# EAGLE design Composino (EAGLE 7.1.0)
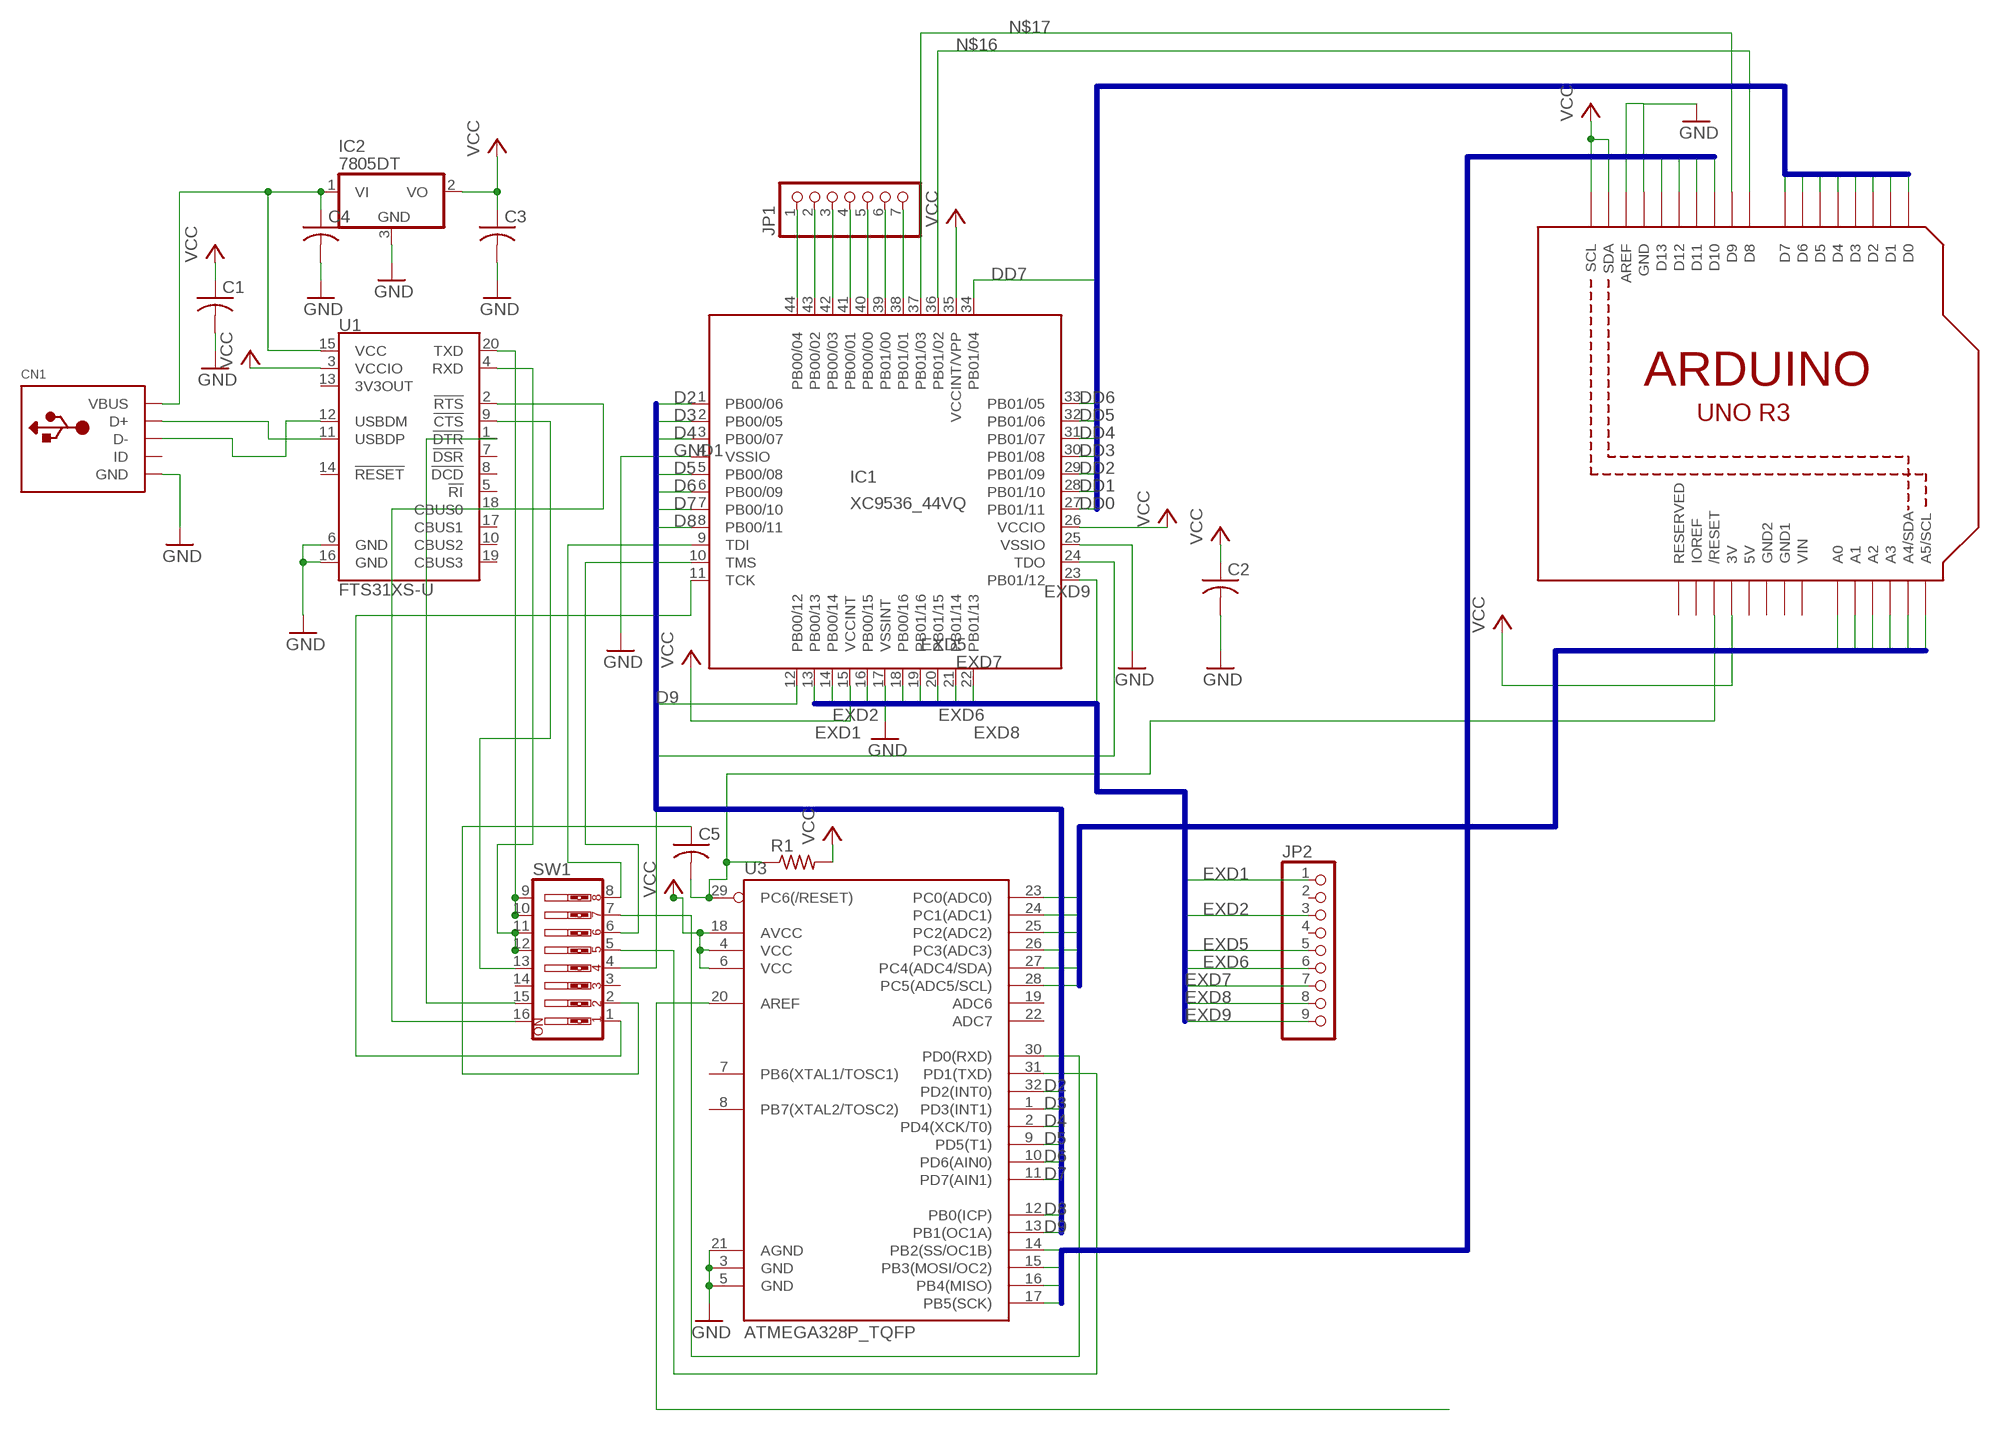
[diagram p0: schematic, sheet 1]

## Parts
C1  C-USC0603K  [C0603K]
C2  C-USC0603K  [C0603K]
C3  C-USC0603K  [C0603K]
C4  C-USC0603K  [C0603K]
C5  C-USC0603K  [C0603K]
CN1  USBMINIBLARGE  [USB-MINIB_LARGER]
IC1  XC9536_44VQ  [SQFP-S-10X10-44]
IC2  7805DT  [TO252]
JP1  HEADER-1X7  [1X07_OVAL]
JP2  HEADER-1X9  [1X09_OVAL]
R1  R-US_R0603  [R0603]
SW1  SW_DIP-8-SMT-HALFSIZE  [DIPSWITCH-08-50MIL]
U1  FTS31XS-U  FT231XS  [SSOP20_L]
U2  ARDUINOR3NODIM  [ARDUINOR3-NODIM]
U3  ATMEGA328P_TQFP  [TQFP32-08]

## Nets
A0: U2.A0 U3.23(PC0(ADC0))
A1: U2.A1 U3.24(PC1(ADC1))
A2: U2.A2 U3.25(PC2(ADC2))
A3: U2.A3 U3.26(PC3(ADC3))
A4: U2.A4(A4/SDA) U3.27(PC4(ADC4/SDA))
A5: U2.A5(A5/SCL) U3.28(PC5(ADC5/SCL))
D2: IC1.1(PB00/06) U3.32(PD2(INT0))
D3: IC1.2(PB00/05) U3.1(PD3(INT1))
D4: IC1.3(PB00/07) U3.2(PD4(XCK/T0))
D5: IC1.5(PB00/08) U3.9(PD5(T1))
D6: IC1.6(PB00/09) U3.10(PD6(AIN0))
D7: IC1.7(PB00/10) U3.11(PD7(AIN1))
D8: IC1.8(PB00/11) U3.12(PB0(ICP))
D9: IC1.12(PB00/12) U3.13(PB1(OC1A))
D10: U2.D10 U3.14(PB2(SS/OC1B))
D11: U2.D11 U3.15(PB3(MOSI/OC2))
D12: U2.D12 U3.16(PB4(MISO))
D13: U2.D13 U3.17(PB5(SCK))
DD0: IC1.27(PB01/11) U2.D0
DD1: IC1.28(PB01/10) U2.D1
DD2: IC1.29(PB01/09) U2.D2
DD3: IC1.30(PB01/08) U2.D3
DD4: IC1.31(PB01/07) U2.D4
DD5: IC1.32(PB01/06) U2.D5
DD6: IC1.33(PB01/05) U2.D6
DD7: IC1.34(PB01/04) U2.D7
EXD1: IC1.13(PB00/13) JP2.1
EXD2: IC1.14(PB00/14) JP2.3
EXD3: IC1.16(PB00/15)
EXD4: IC1.18(PB00/16)
EXD5: IC1.19(PB01/16) JP2.5
EXD6: IC1.20(PB01/15) JP2.6
EXD7: IC1.21(PB01/14) JP2.7
EXD8: IC1.22(PB01/13) JP2.8
EXD9: IC1.23(PB01/12) JP2.9
GND1: C1.2 C2.2 C3.2 C4.2 CN1.GND IC1.4(VSSIO) IC1.17(VSSINT) IC1.25(VSSIO) IC2.3(GND) U1.6(GND) U1.16(GND) U2.AREF U2.GND U3.3(GND) U3.5(GND) U3.21(AGND) ; supply symbol labelled GND
N$1: CN1.D+ U1.11(USBDP)
N$2: CN1.D- U1.12(USBDM)
N$3: C4.1 CN1.VBUS IC2.1(VI) U1.15(VCC)
N$4: IC1.9(TDI) SW1.8
N$5: IC1.10(TMS) SW1.6
N$6: SW1.16 U1.2(!RTS)
N$7: IC1.24(TDO) SW1.4
N$8: SW1.9 SW1.10 U1.20(TXD)
N$9: SW1.7 U3.30(PD0(RXD))
N$10: SW1.11 SW1.12 U1.4(RXD)
N$11: SW1.15 U1.1(!DTR)
N$12: SW1.5 U3.31(PD1(TXD))
N$13: SW1.13 U1.9(!CTS)
N$14: C5.2 R1.1 U2.RESET(/RESET) U3.29(PC6(/RESET))
N$15: C5.1 SW1.2
N$16: IC1.36(PB01/02) U2.D8
N$17: IC1.37(PB01/03) U2.D9
N$18: IC1.38(PB01/01) JP1.7
N$19: IC1.39(PB01/00) JP1.6
N$20: U3.20(AREF)
N$21: IC1.40(PB00/00) JP1.5
N$22: IC1.41(PB00/01) JP1.4
N$23: IC1.42(PB00/03) JP1.3
N$24: IC1.43(PB00/02) JP1.2
N$25: IC1.44(PB00/04) JP1.1
N$26: IC1.11(TCK) SW1.1
VCC: C1.1 C2.1 C3.1 IC1.15(VCCINT) IC1.26(VCCIO) IC1.35(VCCINT/VPP) IC2.2(VO) R1.2 U1.3(VCCIO) U2.3V U2.SCL U2.SDA U3.4(VCC) U3.6(VCC) U3.18(AVCC)
Unconnected: CN1.ID JP2.2 JP2.4 SW1.3 SW1.14 U1.5(!RI) U1.7(!DSR) U1.8(!DCD) U1.10(CBUS2) U1.13(3V3OUT) U1.14(!RESET) U1.17(CBUS1) U1.18(CBUS0) U1.19(CBUS3) U2.IOREF U2.RESERVED U3.7(PB6(XTAL1/TOSC1)) U3.8(PB7(XTAL2/TOSC2)) U3.19(ADC6) U3.22(ADC7)

## Buses
D[2..9]
D[10..13]
A[0..5]
DD[0..7]
EXD[1..9]

## Power pins joined to a net without a drawn wire
5V: U2.5V
GND1: U2.GND1 U2.GND2
VIN: U2.VIN

## Library data of the parts
C1-C5 = rcl:C-US: CAPACITOR, American symbol
CN1 = OLED_mod:USB: USB Connectors USBMINIB - Surface Mount Female Mini-B USB Connector 4UConnector: 06564
IC1 = xilinx-xc9:XC9536_44VQ: xc9536_pc44 XC9500 In-System Programmable CPLD Family Auto generated by make-symbol-device-package-bsdl.ulp Rev. 34 Source: xc9536_vq44.bsd; MPN: XC9536-15VQG44C; OC_FARNELL: 1193227; OC_NEWARK: 98K3377
IC2 = adafruit:78*: Positive VOLTAGE REGULATOR Added bigger pads to the TO-92 package
JP1 = OLED_mod:HEADER-1X7: PIN HEADER
JP2 = OLED_mod:HEADER-1X9: PIN HEADER
R1 = resistor:R-US_: RESISTOR, American symbol
SW1 = SparkFun-Electromechanical:SW_DIP-8: DIP Switch 8 Position
U1 = SparkFun-DigitalIC:FT231X: FTDI FT231X Full Speed USB to Full-handshake UART This USB2.0 Full Speed IC offers a compact bridge to full handshake UART interfaces. The device is a UART, capable of operating up to 3MBaud, with low power consumption (8mA). The FT231X includes the complete FT-X series feature set and enables USB to be added into a system design quickly and easily over a UART interface.; PROD_ID: IC-11524
U2 = OLED_mod:ARDUINOR3: This is a new object for the new Arduino R3 - with extra pins that you may want to use (such as IOref, and duplicated A4/A5
U3 = SparkFun-DigitalIC:ATMEGA328P_TQFP; PROD_ID: IC-09069

## Board
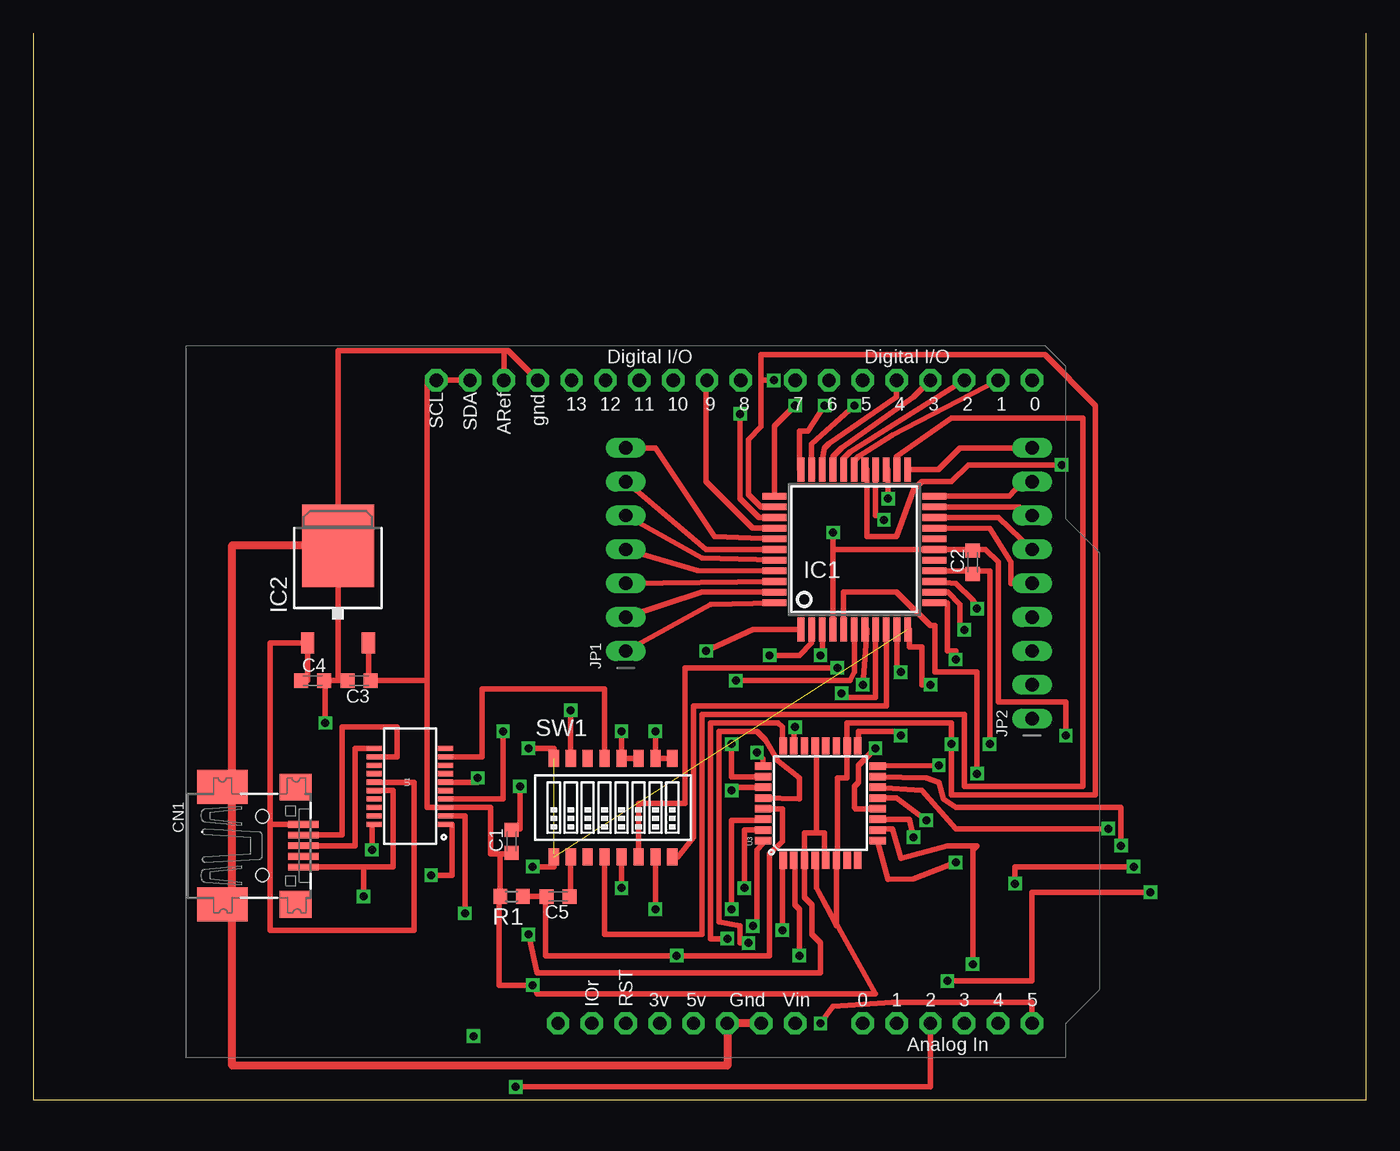
[diagram p1: board, top side]
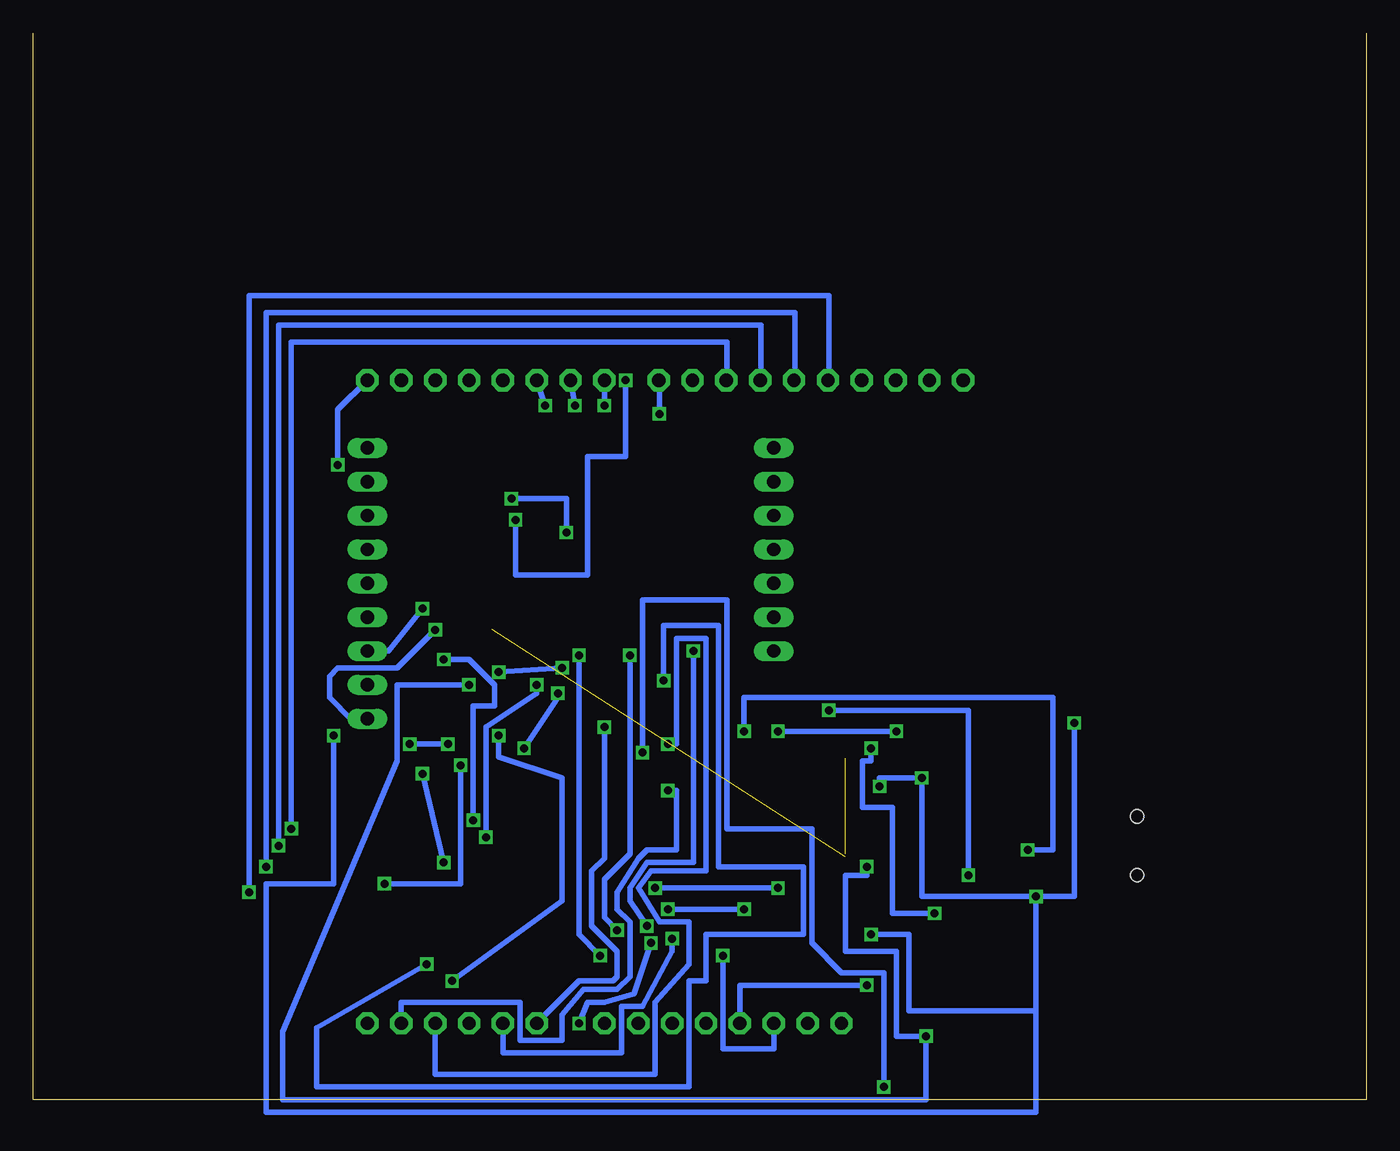
[diagram p2: board, bottom side, seen from below]

Size 100 x 80 mm. Coordinates in mm from the lower left corner, seen from the top.
Outline: 100,80 100,0 0,0 0,80
Copper layers (1*16): Top 0.035mm / dielectric 1.5mm / Bottom 0.035mm
Design rules "default": minimum track width 10mil, minimum drill 24mil, track to track 8mil, track to pad 8mil, pad to pad 8mil, via to via 8mil, smd to smd 8mil, copper to edge 40mil, drill to drill 8mil, minimum pad ring 10mil, minimum via ring 8mil, stop-mask expansion 4mil, vias tented up to drill 0mil, thermal gap 10mil

### Footprints (pad centres in the part's own frame; a part is rotated, then mirrored left to right if it is on the bottom)
C0603K = smd 1.05 x 1.08: 1 -0.875,0; 2 0.875,0
USB-MINIB_LARGER = smd 0.5 x 2.308: D+ 0,4.064; D- -0.8,4.064; GND 1.6,4.064; ID 0.8,4.064; VBUS -1.6,4.064 | smd 2.54 x 3.81: GND1 -4.4,-2; GND4 4.4,-2 | smd 2 x 2.4: GND2 -4.4,3.5; GND3 4.4,3.5 | hole 1: -2.2,1; 2.2,1
SQFP-S-10X10-44 = smd 0.5 x 1.8: 1 -4,-6; 2 -3.2,-6; 3 -2.4,-6; 4 -1.6,-6; 5 -0.8,-6; 6 0,-6; 7 0.8,-6; 8 1.6,-6; 9 2.4,-6; 10 3.2,-6; 11 4,-6; 23 4,6; 24 3.2,6; 25 2.4,6; 26 1.6,6; 27 0.8,6; 28 0,6; 29 -0.8,6; 30 -1.6,6; 31 -2.4,6; 32 -3.2,6; 33 -4,6 | smd 1.8 x 0.5: 12 6,-4; 13 6,-3.2; 14 6,-2.4; 15 6,-1.6; 16 6,-0.8; 17 6,0; 18 6,0.8; 19 6,1.6; 20 6,2.4; 21 6,3.2; 22 6,4; 34 -6,4; 35 -6,3.2; 36 -6,2.4; 37 -6,1.6; 38 -6,0.8; 39 -6,0; 40 -6,-0.8; 41 -6,-1.6; 42 -6,-2.4; 43 -6,-3.2; 44 -6,-4
TO252 = smd 1 x 1.6: 1 -2.28,-4.8; 2 2.28,-4.8 | smd 5.4 x 6.2: 3 0,2.5
1X07_OVAL = drill 1 long: 1 -7.62,0; 2 -5.08,0; 3 -2.54,0; 4 0,0; 5 2.54,0; 6 5.08,0; 7 7.62,0
1X09_OVAL = drill 1 long: 1 -10.16,0; 2 -7.62,0; 3 -5.08,0; 4 -2.54,0; 5 0,0; 6 2.54,0; 7 5.08,0; 8 7.62,0; 9 10.16,0
R0603 = smd 1 x 1.1: 1 -0.85,0; 2 0.85,0
DIPSWITCH-08-50MIL = smd 0.762 x 1.27: 1 -4.445,-3.7; 2 -3.175,-3.7; 3 -1.905,-3.7; 4 -0.635,-3.7; 5 0.635,-3.7; 6 1.905,-3.7; 7 3.175,-3.7; 8 4.445,-3.7; 9 4.445,3.7; 10 3.175,3.7; 11 1.905,3.7; 12 0.635,3.7; 13 -0.635,3.7; 14 -1.905,3.7; 15 -3.175,3.7; 16 -4.445,3.7
SSOP20_L = smd 0.381 x 1.143: 1 -2.857,-2.68; 2 -2.223,-2.68; 3 -1.587,-2.68; 4 -0.953,-2.68; 5 -0.318,-2.68; 6 0.318,-2.68; 7 0.953,-2.68; 8 1.587,-2.68; 9 2.223,-2.68; 10 2.857,-2.68; 11 2.857,2.68; 12 2.223,2.68; 13 1.587,2.68; 14 0.953,2.68; 15 0.318,2.68; 16 -0.318,2.68; 17 -0.953,2.68; 18 -1.587,2.68; 19 -2.223,2.68; 20 -2.857,2.68
ARDUINOR3-NODIM = drill 1 pad 1.676 octagon: 3V 35.56,2.54; 5V 38.1,2.54; A0 50.8,2.54; A1 53.34,2.54; A2 55.88,2.54; A3 58.42,2.54; A4 60.96,2.54; A5 63.5,2.54; AREF 23.876,50.8; D0 63.5,50.8; D1 60.96,50.8; D2 58.42,50.8; D3 55.88,50.8; D4 53.34,50.8; D5 50.8,50.8; D6 48.26,50.8; D7 45.72,50.8; D8 41.656,50.8; D9 39.116,50.8; D10 36.576,50.8; D11 34.036,50.8; D12 31.496,50.8; D13 28.956,50.8; GND 26.416,50.8; GND1 43.18,2.54; GND2 40.64,2.54; IOREF 30.48,2.54; RESERVED 27.94,2.54; RESET 33.02,2.54; SCL 18.796,50.8; SDA 21.336,50.8; VIN 45.72,2.54
TQFP32-08 = smd 1.27 x 0.559: 1 -4.293,2.8; 2 -4.293,2; 3 -4.293,1.2; 4 -4.293,0.4; 5 -4.293,-0.4; 6 -4.293,-1.2; 7 -4.293,-2; 8 -4.293,-2.8; 17 4.293,-2.8; 18 4.293,-2; 19 4.293,-1.2; 20 4.293,-0.4; 21 4.293,0.4; 22 4.293,1.2; 23 4.293,2; 24 4.293,2.8 | smd 0.559 x 1.27: 9 -2.8,-4.293; 10 -2,-4.293; 11 -1.2,-4.293; 12 -0.4,-4.293; 13 0.4,-4.293; 14 1.2,-4.293; 15 2,-4.293; 16 2.8,-4.293; 25 2.8,4.293; 26 2,4.293; 27 1.2,4.293; 28 0.4,4.293; 29 -0.4,4.293; 30 -1.2,4.293; 31 -2,4.293; 32 -2.8,4.293

### Placement (x,y rotation side)
C1  35.88,19.37 90 top
C2  70.48,40.32 90 top
C3  24.45,31.43 180 top
C4  20.95,31.43 0 top
C5  39.37,15.24 180 top
CN1  16.19,19.05 270 top
IC1  61.59,41.27 0 top
IC2  22.86,39.05 0 top
JP1  44.45,41.27 90 top
JP2  74.93,38.73 90 top
R1  35.88,15.24 180 top
SW1  43.5,21.91 0 top
U1  28.26,23.5 90 top
U2  11.43,3.17 0 top
U3  59.05,22.23 90 top

### Tracks (layer width: path | path; a pad name or v marks a point on that pad's centre or on a via)
A0  (via drill 0.6)
  Top 0.406: U3.23 57.05,27.84 v57.15,27.94
  Bottom 0.406: v57.15,27.94 57.15,18.1 58.1,17.14 58.1,13.02 56.2,11.11 56.2,9.21 56.52,8.89 59.05,8.89 U2.A0
A1  (via drill 0.6)
  Top 0.406: U3.24 56.26,26.61 56.2,26.67 56.2,27.94 55.88,28.26 50.8,28.26 50.8,12.06 v52.07,12.06
  Bottom 0.406: v52.07,12.06 52.07,11.11 54.29,6.99 55.88,6.99 55.88,3.49 64.77,3.49 U2.A1
A2  (via drill 0.6)
  Top 0.406: U3.25 54.76,25.57 v54.29,26.04 | v36.2,0.95 67.31,0.95 U2.A2
  Bottom 0.406: v54.29,26.04 54.29,37.47 47.94,37.47 47.94,20.32 41.59,20.32 41.59,11.75 39.37,9.53 36.2,9.53 v36.2,0.95
A3  (via drill 0.6)
  Top 0.406: U3.26 52.39,24.23 v52.39,26.67
  Bottom 0.406: v52.39,26.67 51.75,26.67 51.75,34.61 49.53,34.61 49.53,17.14 53.66,17.14 54.61,15.88 53.02,13.34 50.8,13.34 50.8,10.16 53.34,7.3 53.34,1.91 69.85,1.91 U2.A3
A4  (via drill 0.6)
  Top 0.406: U3.27 52.63,23.43 v52.39,23.18
  Bottom 0.406: v52.39,23.18 51.75,23.18 51.75,18.73 53.98,18.73 54.61,18.1 56.2,15.56 56.2,14.29 55.24,13.34 55.24,9.21 56.2,8.26 58.74,8.26 60.33,6.35 60.33,4.45 63.5,4.45 63.5,7.3 72.39,7.3 U2.A4
A5  (via drill 0.6)
  Top 0.406: U2.A5 74.93,7.3 64.45,7.3 60.01,6.99 v59.05,5.71 | U3.28 57.47,22.54 57.47,24.13 55.88,25.4 54.93,26.99 54.29,27.62 51.44,27.62 51.44,13.34 53.02,13.02 53.02,11.75 v53.66,11.75
  Bottom 0.406: v53.66,11.75 54.93,7.94 57.15,7.3 58.42,7.3 v59.05,5.71
D2  (via drill 0.6)
  Top 0.406: IC1.1 54.01,35.27 v50.48,33.66 | U3.32 54.76,19.2 54.29,18.73 54.29,13.02 v53.98,13.02
  Bottom 0.406: v50.48,33.66 50.48,17.78 53.98,17.78 55.24,15.88 55.24,14.92 v53.98,13.02
D3  (via drill 0.6)
  Top 0.406: IC1.2 58.4,34.27 57.47,33.34 v55.24,33.34 | v56.2,12.7 56.2,17.88 U3.1
  Bottom 0.406: v55.24,33.34 55.24,18.41 57.15,16.51 57.15,13.65 v56.2,12.7
D4  (via drill 0.6)
  Top 0.406: IC1.3 59.2,33.48 v59.05,33.34 | v57.47,10.79 57.47,14.29 57.15,14.61 57.15,17.84 U3.2
  Bottom 0.406: v59.05,33.34 59.05,12.38 v57.47,10.79
D5  (via drill 0.6)
  Top 0.406: U3.9 64.14,16.51 66.04,16.57 v69.22,17.78 | v70.8,24.45 70.8,32.07 67.63,32.07 67.63,35.56 67.31,35.56 64.77,38.1 60.8,38.1 IC1.5
  Bottom 0.406: v69.22,17.78 v70.8,24.45
D6  (via drill 0.6)
  Top 0.406: IC1.6 61.59,32.07 61.28,31.43 v52.7,31.43 | v70.48,10.16 70.48,18.73 70.8,19.05 68.58,19.05 65.09,18.1 64.45,20.32 63.44,20.32 U3.10
  Bottom 0.406: v52.7,31.43 52.7,35.56 48.58,35.56 48.58,17.46 42.23,17.46 42.23,12.38 49.53,12.38 49.53,8.89 50.8,8.89 50.8,0.95 78.74,0.95 78.74,5.4 v70.48,10.16
D7  (via drill 0.6)
  Top 0.406: 62.55,35.27 IC1.7 62.55,35.12 v62.23,31.11 | U3.11 65.72,21.02 v66.04,19.68
  Bottom 0.406: v66.04,19.68 66.04,27.94 62.23,30.48 v62.23,31.11
D8  (via drill 0.6)
  Top 0.406: IC1.8 63.18,35.27 63.18,30.16 60.64,30.16 v60.64,30.48 | U3.12 61.68,21.82 61.59,21.91 61.59,23.5 61.91,23.81 61.91,25.08 v63.18,26.35
  Bottom 0.406: v60.64,30.48 60.64,30.16 v63.18,26.35
D9  (via drill 0.6)
  Top 0.406: IC1.12 68.58,37.27 68.58,33.66 68.9,33.66 | 68.9,33.66 69.22,33.66 | U3.13 64.77,22.62 v66.99,20.95 | v69.22,33.02 69.22,33.34 68.9,33.66
  Bottom 0.406: v66.99,20.95 66.99,29.53 65.41,29.53 65.41,31.11 67.31,33.02 v69.22,33.02
D10  (via drill 0.6)
  Top 0.406: v80.64,20.32 73.03,20.32 72.39,20.32 69.22,20.32 66.67,23.18 U3.14
  Bottom 0.406: U2.D10 47.94,53.98 47.94,56.83 80.64,56.83 v80.64,20.32
D11  (via drill 0.6)
  Top 0.406: v81.6,19.05 81.6,21.91 69.22,21.91 68.26,22.54 67.94,23.81 66.99,24.13 U3.15
  Bottom 0.406: U2.D11 45.4,53.98 45.4,58.1 81.6,58.1 v81.6,19.05
D12  (via drill 0.6)
  Top 0.406: v82.55,17.46 73.66,17.46 v73.66,16.19 | U3.16 v67.94,25.08
  Bottom 0.406: U2.D12 42.86,53.98 42.86,59.05 82.55,59.05 v82.55,17.46 | v67.94,25.08 67.94,16.19 v73.66,16.19
D13  (via drill 0.6)
  Top 0.406: v83.82,15.56 74.93,15.56 74.93,8.89 v68.58,8.89 | U3.17 61.91,27.62 64.77,27.62 v65.09,27.3
  Bottom 0.406: U2.D13 40.32,53.98 40.32,60.33 83.82,60.33 v83.82,15.56 | v65.09,27.3 65.09,25.72 60.33,24.13 60.33,14.92 v68.58,8.89
DD0  (via drill 0.6)
  Top 0.406: IC1.27 62.55,47.27 62.55,42.23 64.77,42.23 66.04,45.72 66.67,46.35 68.9,46.35 70.17,47.62 v77.15,47.62
  Bottom 0.406: v77.15,47.62 77.15,51.75 U2.D0
DD1
  Top 0.406: IC1.28 61.59,47.94 61.91,48.26 64.45,49.85 U2.D1
DD2
  Top 0.406: IC1.29 60.8,48.09 61.28,48.58 U2.D2
DD3
  Top 0.406: IC1.30 59.99,48.25 60.64,48.9 66.04,52.7 U2.D3
DD4
  Top 0.406: IC1.31 59.2,48.08 59.37,48.9 59.69,49.21 64.77,52.7 U2.D4
DD5  (via drill 0.6)
  Top 0.406: IC1.32 58.4,49.19 58.74,49.53 v61.59,52.07
  Bottom 0.406: v61.59,52.07 U2.D5
DD6  (via drill 0.6)
  Top 0.406: IC1.33 57.47,47.27 57.47,50.16 58.1,50.16 v59.37,52.07
  Bottom 0.406: v59.37,52.07 U2.D6
DD7  (via drill 0.6)
  Top 0.406: IC1.34 55.59,50.52 v57.15,52.07
  Bottom 0.406: v57.15,52.07 U2.D7
EXD1  (via drill 0.6)
  Top 0.406: IC1.13 68.61,38.08 69.53,37.15 69.53,35.56 v69.85,35.24
  Bottom 0.406: v69.85,35.24 72.71,32.38 77.15,32.38 77.79,31.75 77.79,30.16 76.2,28.57 JP2.1
EXD2  (via drill 0.6)
  Top 0.406: IC1.14 69.22,38.73 70.48,37.47 v70.8,36.83
  Bottom 0.406: v70.8,36.83 73.34,33.66 JP2.3
EXD5
  Top 0.406: IC1.19 71.75,42.86 73.34,40.32 73.34,38.73 JP2.5
EXD6
  Top 0.406: IC1.20 72.39,43.67 JP2.6 75.56,41.27
EXD7
  Top 0.406: IC1.21 73.98,44.48 JP2.7
EXD8
  Top 0.406: IC1.22 73.22,45.27 73.66,45.72 JP2.8
EXD9
  Top 0.406: IC1.23 67.91,47.27 69.53,48.9 JP2.9
GND1  (via drill 0.6)
  Top 0.406: C3.2 C4.2 | U3.5 59.37,17.93 59.37,20 58.74,20 | 58.74,20 57.85,20 U3.3 57.85,15.17 58.42,14.61 58.42,12.38 59.05,11.75 59.05,9.53 37.78,9.53 v37.15,12.38 | U3.21 58.74,26.52 58.74,20 | U1.6 33.34,23.81 v33.34,24.13 | v36.51,23.5 36.51,20.32 35.88,20.32 C1.2 | CN1.GND 26.99,17.45 26.99,17.46 | U1.16 26.99,23.18 26.99,17.46 | 26.99,17.46 24.77,17.46 v24.77,15.24 | C3.2 22.86,31.43 IC2.3 22.86,41.59 22.86,56.2 35.31,56.2 | C3.2 21.91,31.43 v21.91,28.26 | IC1.17 70.41,41.27 C2.2 | IC1.17 60.01,41.27 | 60.01,41.27 59.99,41.27 | 59.99,41.27 IC1.4 60.01,35.27 60.01,41.27 | IC1.25 64.14,47.27 v64.14,45.09 | v60.01,42.55 59.99,42.55 59.99,41.27 | IC1.17 71.44,41.27 72.39,40.32 72.39,29.84 77.47,29.84 v77.47,27.3 | U2.GND 35.62,56.2 35.31,56.2 | 35.31,56.2 U2.AREF
  Top 0.61: U2.GND1 U2.GND2 52.07,2.54 14.92,2.54 14.92,41.59 22.86,41.59
  Bottom 0.406: v36.51,23.5 36.51,24.13 v33.34,24.13 33.34,15.24 v24.77,15.24 | v21.91,28.26 21.91,15.24 v24.77,15.24 | v37.15,12.38 34.29,12.38 34.29,6.67 24.77,6.67 | 24.77,6.67 v24.77,15.24 | v64.14,45.09 60.01,45.09 v60.01,42.55 | v77.47,27.3 77.47,16.19 82.55,16.19 82.55,-0.95 24.77,-0.95 24.77,6.67
N$1
  Top 0.406: CN1.D+ 24.13,19.05 24.13,26.35 U1.11
N$2
  Top 0.406: CN1.D- 23.18,19.85 23.18,27.94 27.3,27.94 27.3,25.72 U1.12
N$3
  Top 0.406: C4.1 20.58,31.43 IC2.1 17.78,34.25 17.78,20.64 | 17.78,20.64 20.26,20.64 CN1.VBUS | U1.15 28.57,23.81 28.57,12.7 17.78,12.7 17.78,20.64
N$4
  Top 0.406: SW1.8 48.37,18.21 49.53,19.68 49.53,29.53 63.99,29.53 IC1.9
N$5  (via drill 0.6)
  Top 0.406: SW1.6 45.4,22.23 48.9,22.23 48.9,32.38 v60.33,32.38 | v65.09,32.07 64.8,32.07 IC1.10
  Bottom 0.406: v60.33,32.38 v65.09,32.07
N$6  (via drill 0.6)  (1 unrouted)
  Top 0.406: U1.2 32.38,21.27 v32.38,13.97 | 65.72,35.27 65.72,33.97 66.67,33.97 66.67,31.11 v67.31,31.11 | v37.47,17.46 39.05,17.46 39.05,18.41 | v37.15,26.35 39.05,26.35 SW1.16
  Bottom 0.406: v67.31,31.11 72.71,31.11 72.71,25.4 81.28,5.08 81.28,0 33.02,0 v33.02,4.76 35.24,4.76 35.24,11.11 39.05,11.11 39.05,16.83 37.47,16.83 v37.47,17.46 | v32.38,13.97 35.56,13.97 35.56,21.91 37.78,21.91 37.78,25.4 37.15,25.4 v37.15,26.35
N$7
  Top 0.406: SW1.4 42.86,12.38 50.16,12.38 50.16,28.89 69.85,28.89 69.85,23.5 78.74,23.5 78.74,51.12 68.9,51.12 64.77,48.26 64.77,47.3 IC1.24
N$8  (via drill 0.6)
  Top 0.406: SW1.9 SW1.10 v46.67,27.62 | U1.20 25.4,20.64 v25.4,18.73
  Bottom 0.406: v25.4,18.73 23.5,18.73 23.5,30.16 46.67,30.16 v46.67,27.62
N$9  (via drill 0.6)
  Top 0.406: SW1.7 v46.67,14.29 | v52.39,14.29 52.39,20.95 54.76,20.95 U3.30
  Bottom 0.406: v46.67,14.29 v52.39,14.29
N$10  (via drill 0.6)
  Top 0.406: SW1.11 SW1.12 v44.13,27.62 | U1.4 35.24,22.54 v35.24,27.62
  Bottom 0.406: v35.24,27.62 v44.13,27.62
N$11  (via drill 0.6)
  Top 0.406: U1.1 31.43,20.64 31.43,16.83 v29.84,16.83 | SW1.15 v40.32,29.21
  Bottom 0.406: v40.32,29.21 29.84,29.21 v29.84,16.83
N$12  (via drill 0.6)
  Top 0.406: U3.31 53.34,20.23 v53.34,15.88 | v44.13,15.88 SW1.5
  Bottom 0.406: v53.34,15.88 v44.13,15.88
N$13
  Top 0.406: SW1.13 42.86,30.8 33.66,30.8 33.66,25.72 U1.9
N$14  (via drill 0.6)
  Top 0.406: R1.1 C5.2 38.42,15.24 38.42,10.79 v48.26,10.79 55.24,10.79 55.24,18.41 56.2,19.37 56.2,21.82 U3.29
  Bottom 0.406: v48.26,10.79 48.26,3.81 44.45,3.81 U2.RESET
N$15
  Top 0.406: C5.1 40.32,15.24 SW1.2
N$16  (via drill 0.6)
  Top 0.406: IC1.36 54.43,43.67 53.02,45.09 v53.02,51.44
  Bottom 0.406: v53.02,51.44 53.02,53.91 U2.D8
N$17
  Top 0.406: IC1.37 53.96,42.88 50.48,46.35 50.48,53.91 U2.D9
N$18
  Top 0.406: IC1.38 51.12,42.23 46.67,48.9 JP1.7
N$19
  Top 0.406: IC1.39 50.48,41.27 JP1.6
N$21
  Top 0.406: IC1.40 50.16,40.64 JP1.5
N$22
  Top 0.406: IC1.41 49.85,39.69 JP1.4
N$23
  Top 0.406: IC1.42 JP1.3
N$24
  Top 0.406: IC1.43 50.16,38.1 JP1.2
N$25
  Top 0.406: IC1.44 50.8,37.15 JP1.1
N$26  (1 unrouted)
VCC  (via drill 0.6)
  Top 0.406: IC2.2 25.14,31.43 C3.1 29.53,31.43 | 29.53,31.43 29.53,21.91 U1.3 34.29,21.91 34.29,18.41 35.03,18.41 | U3.4 58.74,17.93 58.74,15.88 | 58.74,15.88 63.18,7.94 37.78,7.94 v37.47,8.57 34.92,8.57 34.92,15.24 R1.2 35.03,18.41 | 35.03,18.41 35.88,18.41 C1.1 | 58.74,15.88 60.26,13.02 | 60.33,13.02 60.26,13.02 | 60.26,13.02 U3.6 60.33,17.93 60.33,24.13 61.05,24.13 U3.18 61.05,28.26 68.9,28.26 v68.9,26.67 68.9,22.86 79.69,22.86 79.69,52.07 75.88,55.88 54.61,55.88 54.61,53.98 | C2.1 70.26,39.67 IC1.15 71.75,39.67 v71.75,26.67 | IC1.35 54.59,44.48 53.66,45.4 53.66,49.53 54.61,50.48 54.61,53.98 | IC1.26 63.2,43.83 63.18,43.81 63.5,43.81 v63.82,43.5 | v55.56,53.98 54.61,53.98 | U2.SDA U2.SCL 29.53,53.98 29.53,31.43
  Bottom 0.406: v37.47,8.57 46.99,8.57 U2.3V | v71.75,26.67 v68.9,26.67 | v63.82,43.5 63.82,39.37 58.42,39.37 58.42,48.26 55.56,48.26 v55.56,53.98